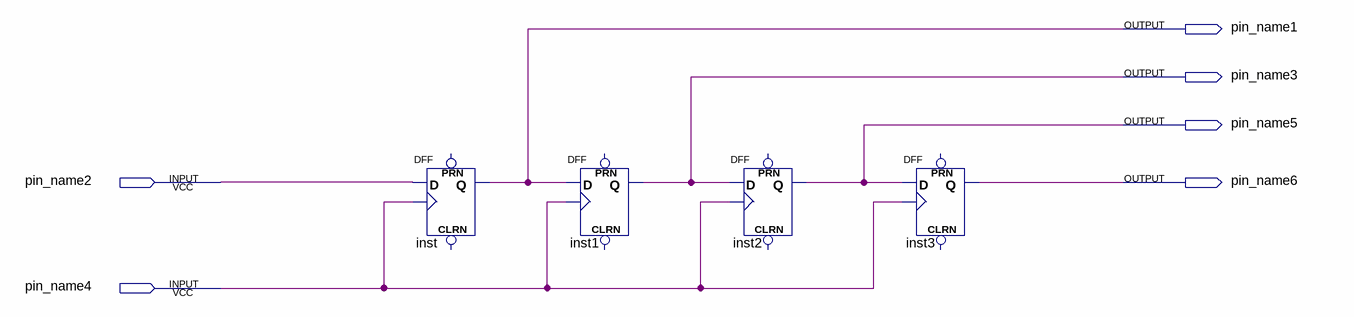
[diagram p0: schematic sheet]
// Quartus schematic serialparallel.bdf as structural Verilog: 4 symbols, 6 pins
module serialparallel (
  input  pin_name2,
  input  pin_name4,
  output pin_name1,
  output pin_name3,
  output pin_name5,
  output pin_name6
);

  DFF inst (.CLK(pin_name4), .D(pin_name2), .Q(pin_name1));  // open: CLRN, PRN
  DFF inst1 (.CLK(pin_name4), .D(pin_name1), .Q(pin_name3));  // open: CLRN, PRN
  DFF inst2 (.CLK(pin_name4), .D(pin_name3), .Q(pin_name5));  // open: CLRN, PRN
  DFF inst3 (.CLK(pin_name4), .D(pin_name5), .Q(pin_name6));  // open: CLRN, PRN
endmodule
